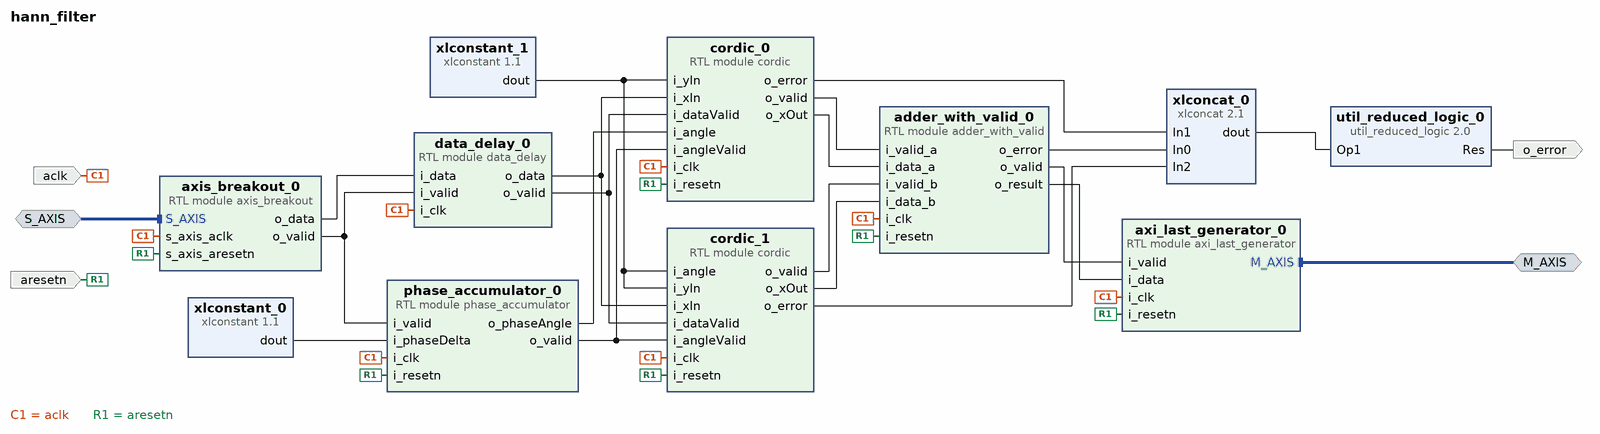
[diagram p0: block diagram of the top level]
# Vivado block design hann_filter, xc7z020clg484-1, Vivado 2019.2
create_bd_design hann_filter

create_bd_intf_port -mode Master -vlnv xilinx.com:interface:axis_rtl:1.0 M_AXIS
set_property -dict {CONFIG.FREQ_HZ 80000000} [get_bd_intf_ports M_AXIS]
create_bd_intf_port -mode Slave -vlnv xilinx.com:interface:axis_rtl:1.0 S_AXIS
set_property -dict [list \
  CONFIG.TDATA_NUM_BYTES 4 \
  CONFIG.TDEST_WIDTH 0 \
  CONFIG.TID_WIDTH 0 \
  CONFIG.TUSER_WIDTH 0 \
  CONFIG.HAS_TREADY 0 \
  CONFIG.HAS_TSTRB 0 \
  CONFIG.HAS_TKEEP 0 \
  CONFIG.HAS_TLAST 0 \
  CONFIG.FREQ_HZ 80000000 \
  CONFIG.LAYERED_METADATA {xilinx.com:interface:datatypes:1.0 {TDATA {datatype {name {attribs {resolve_type immediate dependency {} format string minimum {} maximum {}} value {}} bitwidth {attribs {resolve_type automatic dependency {} format long minimum {} maximum {}} value 32} bitoffset {attribs {resolve_type immediate dependency {} format long minimum {} maximum {}} value 0} array_type {name {attribs {resolve_type immediate dependency {} format string minimum {} maximum {}} value chan} size {attribs {resolve_type generated dependency chan_size format long minimum {} maximum {}} value 1} stride {attribs {resolve_type generated dependency chan_stride format long minimum {} maximum {}} value 32} datatype {name {attribs {resolve_type immediate dependency {} format string minimum {} maximum {}} value {}} bitwidth {attribs {resolve_type automatic dependency {} format long minimum {} maximum {}} value 32} bitoffset {attribs {resolve_type immediate dependency {} format long minimum {} maximum {}} value 0} array_type {name {attribs {resolve_type immediate dependency {} format string minimum {} maximum {}} value path} size {attribs {resolve_type generated dependency path_size format long minimum {} maximum {}} value 1} stride {attribs {resolve_type generated dependency path_stride format long minimum {} maximum {}} value 32} datatype {name {attribs {resolve_type immediate dependency {} format string minimum {} maximum {}} value {}} bitwidth {attribs {resolve_type generated dependency out_width format long minimum {} maximum {}} value 32} bitoffset {attribs {resolve_type immediate dependency {} format long minimum {} maximum {}} value 0} real {fixed {fractwidth {attribs {resolve_type generated dependency out_fractwidth format long minimum {} maximum {}} value 0} signed {attribs {resolve_type generated dependency out_signed format bool minimum {} maximum {}} value true}}}}}}}}} TDATA_WIDTH 32 TUSER {datatype {name {attribs {resolve_type immediate dependency {} format string minimum {} maximum {}} value {}} bitwidth {attribs {resolve_type automatic dependency {} format long minimum {} maximum {}} value 0} bitoffset {attribs {resolve_type immediate dependency {} format long minimum {} maximum {}} value 0} struct {field_data_valid {name {attribs {resolve_type immediate dependency {} format string minimum {} maximum {}} value data_valid} enabled {attribs {resolve_type generated dependency data_valid_enabled format bool minimum {} maximum {}} value false} datatype {name {attribs {resolve_type immediate dependency {} format string minimum {} maximum {}} value {}} bitwidth {attribs {resolve_type generated dependency data_valid_bitwidth format long minimum {} maximum {}} value 0} bitoffset {attribs {resolve_type immediate dependency {} format long minimum {} maximum {}} value 0}}} field_chanid {name {attribs {resolve_type immediate dependency {} format string minimum {} maximum {}} value chanid} enabled {attribs {resolve_type generated dependency chanid_enabled format bool minimum {} maximum {}} value false} datatype {name {attribs {resolve_type immediate dependency {} format string minimum {} maximum {}} value {}} bitwidth {attribs {resolve_type generated dependency chanid_bitwidth format long minimum {} maximum {}} value 0} bitoffset {attribs {resolve_type generated dependency chanid_bitoffset format long minimum {} maximum {}} value 0} integer {signed {attribs {resolve_type immediate dependency {} format bool minimum {} maximum {}} value false}}}} field_user {name {attribs {resolve_type immediate dependency {} format string minimum {} maximum {}} value user} enabled {attribs {resolve_type generated dependency user_enabled format bool minimum {} maximum {}} value false} datatype {name {attribs {resolve_type immediate dependency {} format string minimum {} maximum {}} value {}} bitwidth {attribs {resolve_type generated dependency user_bitwidth format long minimum {} maximum {}} value 0} bitoffset {attribs {resolve_type generated dependency user_bitoffset format long minimum {} maximum {}} value 0}}}}}} TUSER_WIDTH 0}} \
] [get_bd_intf_ports S_AXIS]
create_bd_port -dir O o_error
create_bd_port -dir I -type clk aclk
set_property -dict {CONFIG.ASSOCIATED_BUSIF S_AXIS:M_AXIS CONFIG.FREQ_HZ 80000000} [get_bd_ports aclk]
create_bd_port -dir I -type rst aresetn

create_bd_cell -type module -reference cordic cordic_0
set_property -dict {CONFIG.INPUT_DATA_WIDTH 32 CONFIG.ITERATIONS 30} [get_bd_cells cordic_0]
create_bd_cell -type module -reference cordic cordic_1
set_property -dict {CONFIG.INPUT_DATA_WIDTH 32 CONFIG.ITERATIONS 30} [get_bd_cells cordic_1]
create_bd_cell -type module -reference phase_accumulator phase_accumulator_0
set_property -dict {CONFIG.RESET_VALUE 2145386496} [get_bd_cells phase_accumulator_0]
create_bd_cell -type ip -vlnv xilinx.com:ip:util_reduced_logic:2.0 util_reduced_logic_0
set_property -dict {CONFIG.C_OPERATION or CONFIG.C_SIZE 3} [get_bd_cells util_reduced_logic_0]
create_bd_cell -type ip -vlnv xilinx.com:ip:xlconcat:2.1 xlconcat_0
set_property -dict {CONFIG.NUM_PORTS 3} [get_bd_cells xlconcat_0]
create_bd_cell -type ip -vlnv xilinx.com:ip:xlconstant:1.1 xlconstant_0
set_property -dict {CONFIG.CONST_VAL 2097152 CONFIG.CONST_WIDTH 32} [get_bd_cells xlconstant_0]
create_bd_cell -type ip -vlnv xilinx.com:ip:xlconstant:1.1 xlconstant_1
set_property -dict {CONFIG.CONST_VAL 0 CONFIG.CONST_WIDTH 32} [get_bd_cells xlconstant_1]
create_bd_cell -type module -reference axi_last_generator axi_last_generator_0
set_property -dict {CONFIG.DATA_WIDTH 32} [get_bd_cells axi_last_generator_0]
create_bd_cell -type module -reference adder_with_valid adder_with_valid_0
set_property -dict {CONFIG.DATA_WIDTH 32} [get_bd_cells adder_with_valid_0]
create_bd_cell -type module -reference axis_breakout axis_breakout_0
set_property -dict {CONFIG.DATA_WIDTH 32} [get_bd_cells axis_breakout_0]
create_bd_cell -type module -reference data_delay data_delay_0

# ---- connections ----

connect_bd_intf_net [get_bd_intf_ports M_AXIS] [get_bd_intf_pins axi_last_generator_0/M_AXIS]
connect_bd_intf_net [get_bd_intf_ports S_AXIS] [get_bd_intf_pins axis_breakout_0/S_AXIS]
connect_bd_net [get_bd_pins adder_with_valid_0/o_error] [get_bd_pins xlconcat_0/In0]
connect_bd_net [get_bd_pins adder_with_valid_0/o_valid] [get_bd_pins axi_last_generator_0/i_valid]
connect_bd_net [get_bd_pins axis_breakout_0/o_data] [get_bd_pins data_delay_0/i_data]
connect_bd_net [get_bd_pins axis_breakout_0/o_valid] [get_bd_pins phase_accumulator_0/i_valid] [get_bd_pins data_delay_0/i_valid]
connect_bd_net [get_bd_pins cordic_0/o_error] [get_bd_pins xlconcat_0/In1]
connect_bd_net [get_bd_pins cordic_0/o_valid] [get_bd_pins adder_with_valid_0/i_valid_a]
connect_bd_net [get_bd_pins cordic_0/o_xOut] [get_bd_pins adder_with_valid_0/i_data_a]
connect_bd_net [get_bd_pins cordic_1/o_error] [get_bd_pins xlconcat_0/In2]
connect_bd_net [get_bd_pins cordic_1/o_valid] [get_bd_pins adder_with_valid_0/i_valid_b]
connect_bd_net [get_bd_pins cordic_1/o_xOut] [get_bd_pins adder_with_valid_0/i_data_b]
connect_bd_net [get_bd_pins data_delay_0/o_data] [get_bd_pins cordic_0/i_xIn] [get_bd_pins cordic_1/i_xIn]
connect_bd_net [get_bd_pins data_delay_0/o_valid] [get_bd_pins cordic_0/i_dataValid] [get_bd_pins cordic_1/i_dataValid]
connect_bd_net [get_bd_pins phase_accumulator_0/o_phaseAngle] [get_bd_pins cordic_0/i_angle]
connect_bd_net [get_bd_pins phase_accumulator_0/o_valid] [get_bd_pins cordic_0/i_angleValid] [get_bd_pins cordic_1/i_angleValid]
connect_bd_net -net s_axis_aclk_0_1 [get_bd_ports aclk] \
  [get_bd_pins phase_accumulator_0/i_clk] [get_bd_pins cordic_0/i_clk] [get_bd_pins cordic_1/i_clk] \
  [get_bd_pins axi_last_generator_0/i_clk] [get_bd_pins adder_with_valid_0/i_clk] [get_bd_pins axis_breakout_0/s_axis_aclk] \
  [get_bd_pins data_delay_0/i_clk]
connect_bd_net -net s_axis_aresetn_0_1 [get_bd_ports aresetn] \
  [get_bd_pins phase_accumulator_0/i_resetn] [get_bd_pins cordic_0/i_resetn] [get_bd_pins cordic_1/i_resetn] \
  [get_bd_pins axi_last_generator_0/i_resetn] [get_bd_pins adder_with_valid_0/i_resetn] \
  [get_bd_pins axis_breakout_0/s_axis_aresetn]
connect_bd_net [get_bd_pins util_reduced_logic_0/Res] [get_bd_ports o_error]
connect_bd_net [get_bd_pins xlconcat_0/dout] [get_bd_pins util_reduced_logic_0/Op1]
connect_bd_net [get_bd_pins xlconstant_0/dout] [get_bd_pins phase_accumulator_0/i_phaseDelta]
connect_bd_net [get_bd_pins xlconstant_1/dout] [get_bd_pins cordic_0/i_yIn] [get_bd_pins cordic_1/i_yIn] [get_bd_pins cordic_1/i_angle]
connect_bd_net [get_bd_pins adder_with_valid_0/o_result] [get_bd_pins axi_last_generator_0/i_data]

validate_bd_design
save_bd_design
